# EAGLE design open-lux-T-fixbutt (EAGLE 6.5.0)
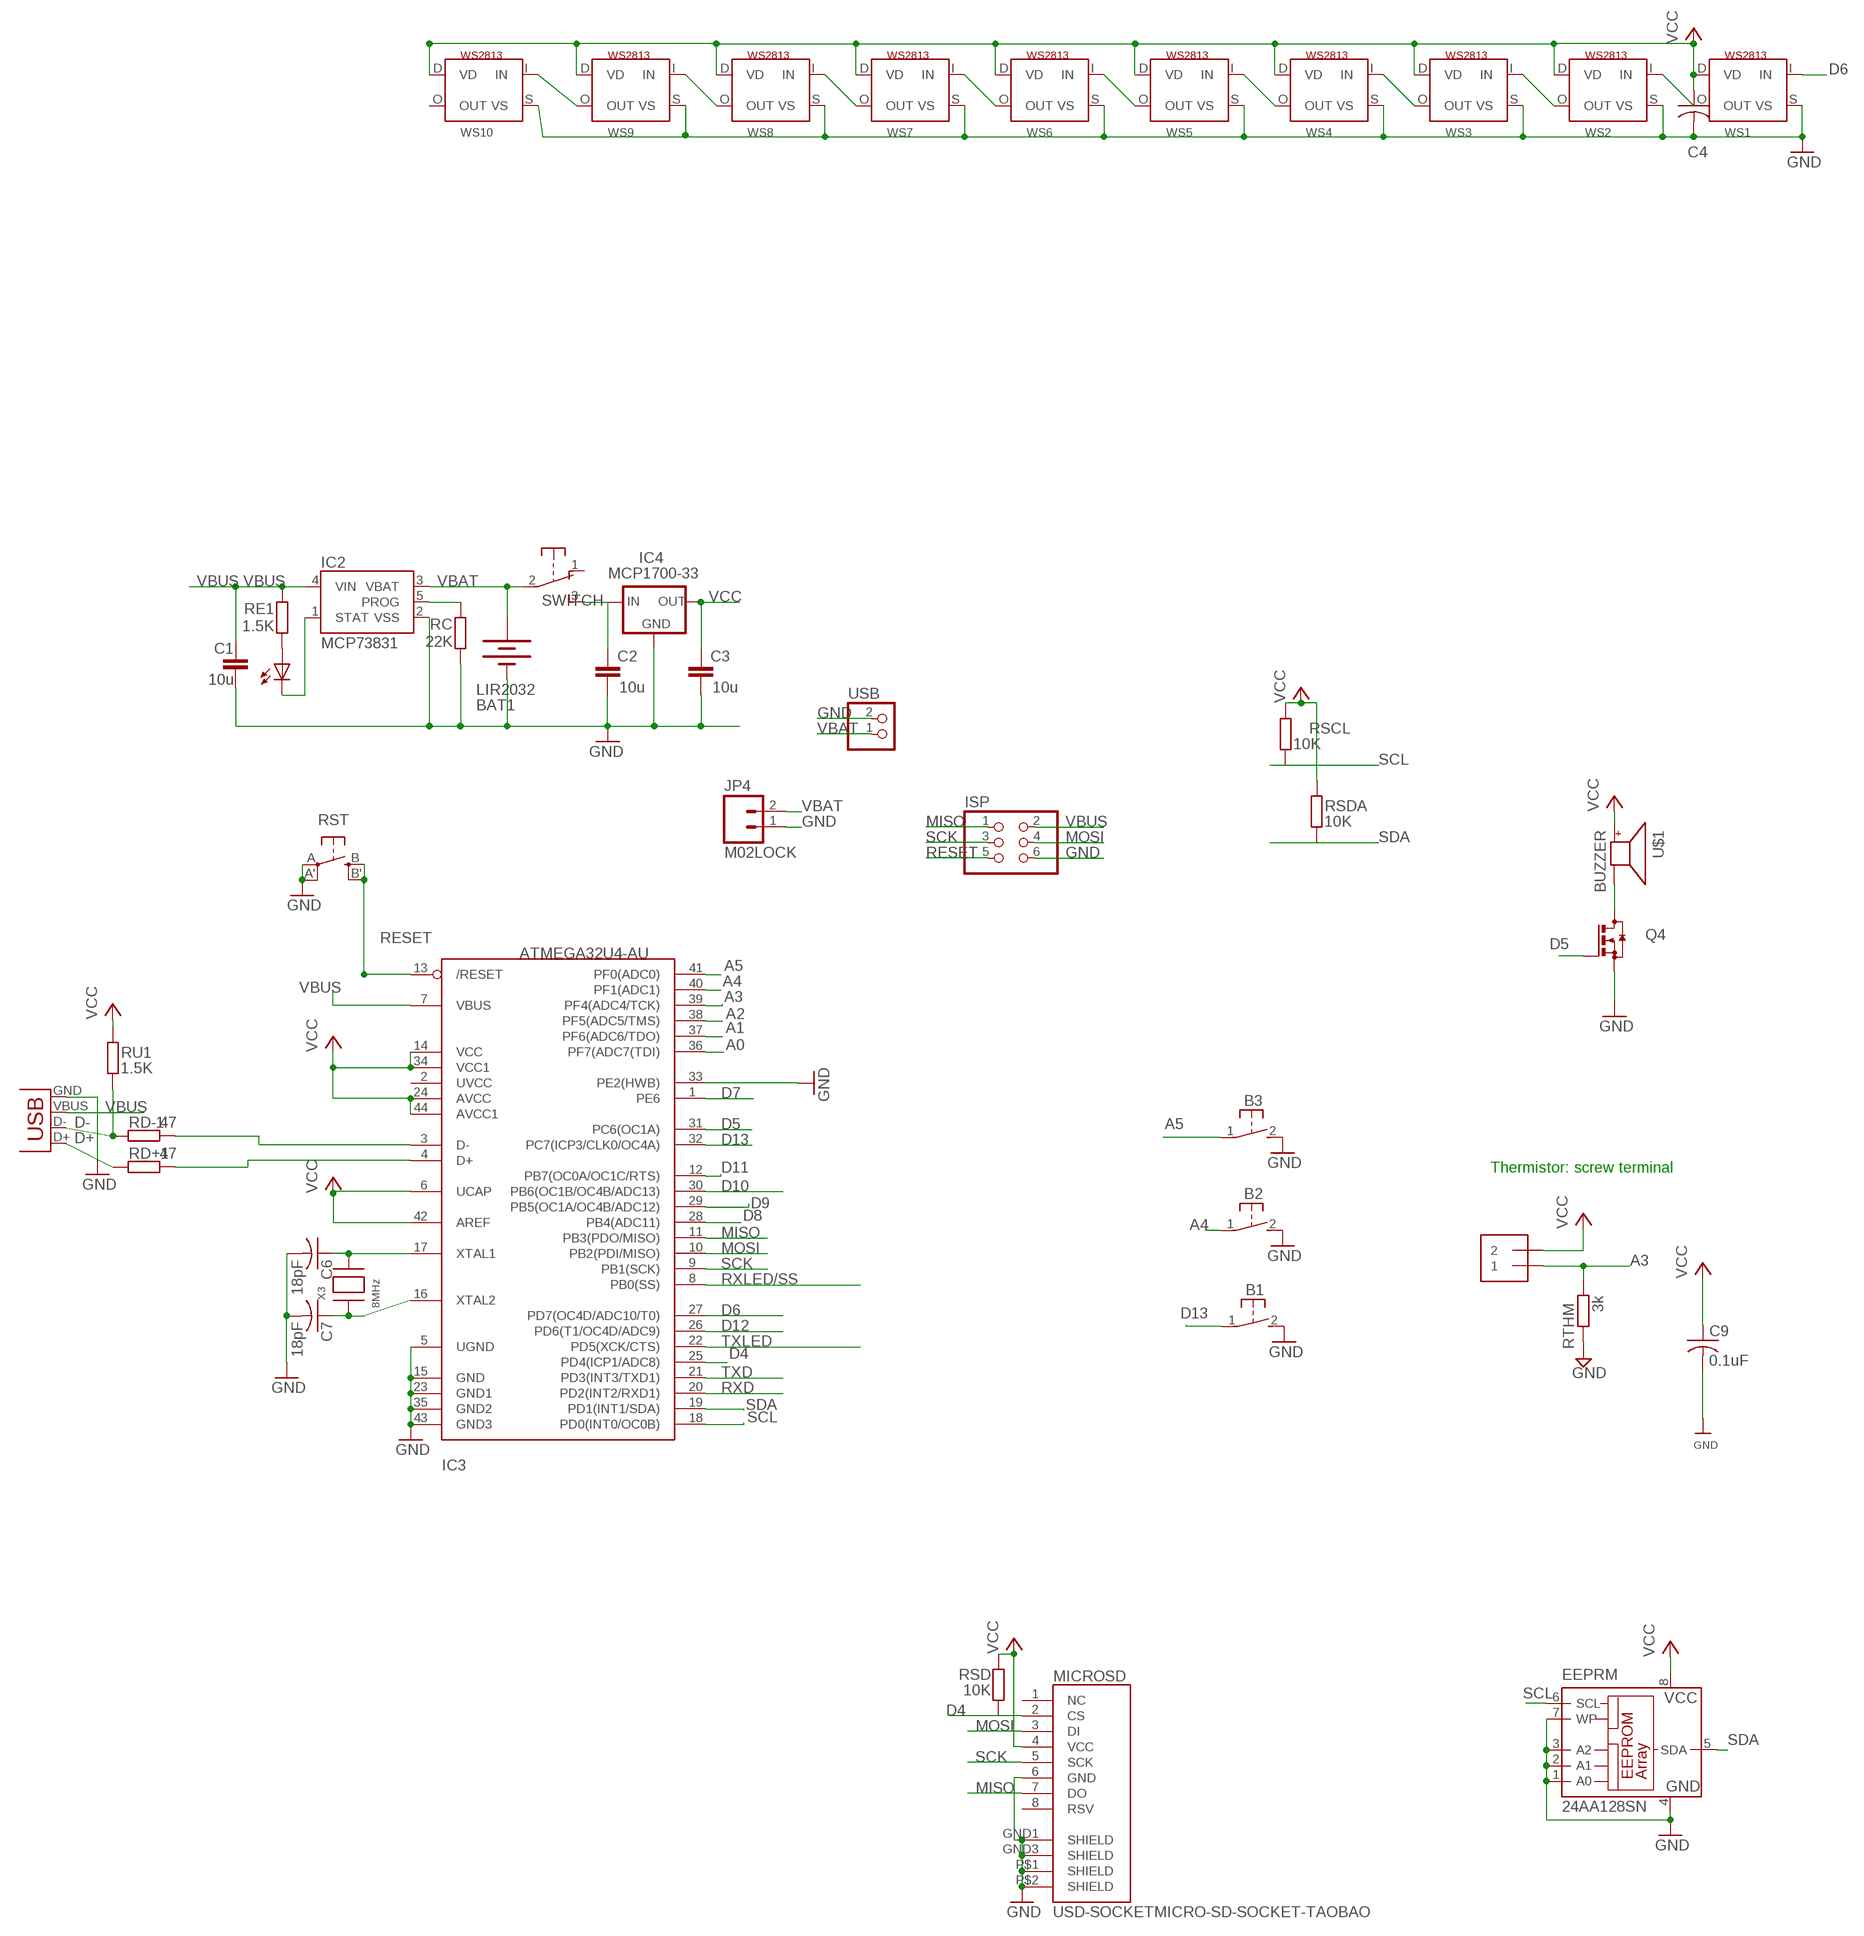
[diagram p0: schematic, sheet 1, part 1 of 2]
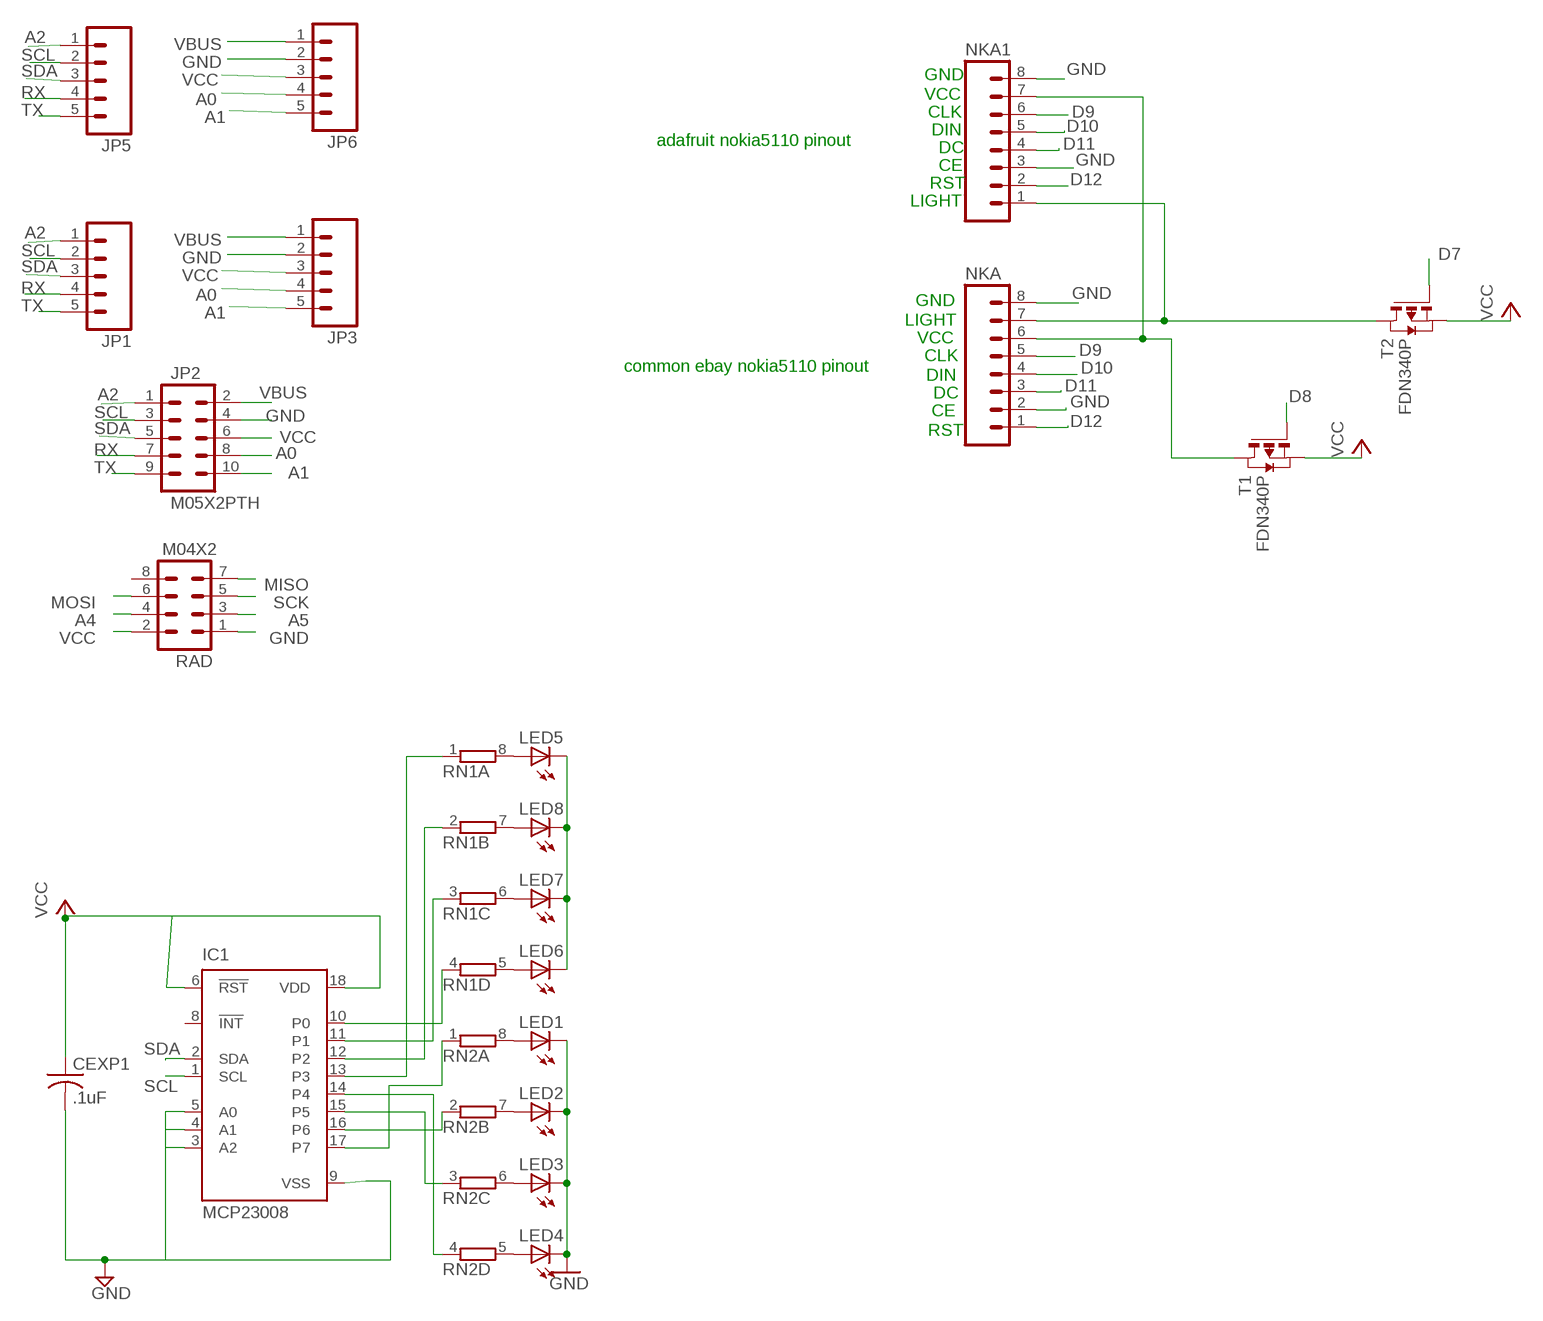
[diagram p1: schematic, sheet 1, part 2 of 2]

## Parts
B1  31-XX  [B3F-31XX]
B2  31-XX  [B3F-31XX]
B3  31-XX  [B3F-31XX]
BAT1  LIR2032  BATTERYBATTCOM_20MM_PTH_SMT  [BATTCOM_20MM_PTH_SMT]
C1  10u  C-EUC0805  [C0805]
C2  10u  C-EUC0805  [C0805]
C3  10u  C-EUC0805  [C0805]
C4  C-USC0805K  [C0805K]
C6  18pF  C-USC0805K  [C0805K]
C7  18pF  C-USC0805K  [C0805K]
C9  0.1uF  C-USC0805  [C0805]
CEXP1  .1uF  C-USC0805K  [C0805K]
EEPRM  24AA128SN  [SO-08]
IC1  MCP23008  MCP23008T  [SO18W]
IC2  MCP73831  [SOT23-5]
IC3  ATMEGA32U4-AU  [TQFP44]
IC4  MCP1700-33  MCP1700SOT233  [SOT23]
ISP  PINHD-2X3  [2X03]
JP1  M05LOCK  [1X05_LOCK]
JP2  M05X2PTH  [AVR_ICSP]
JP3  M05LOCK  [1X05_LOCK]
JP4  M02LOCK  [1X02_LOCK]
JP5  M05LOCK  [1X05_LOCK]
JP6  M05LOCK  [1X05_LOCK]
LED1  LED3MM  [LED3MM]
LED2  LED3MM  [LED3MM]
LED3  LED3MM  [LED3MM]
LED4  LED3MM  [LED3MM]
LED5  LED3MM  [LED3MM]
LED6  LED3MM  [LED3MM]
LED7  LED3MM  [LED3MM]
LED8  LED3MM  [LED3MM]
MICROSD  USD-SOCKETMICRO-SD-SOCKET-TAOBAO  [MICRO-SD-SOCKET-TAOBAO]
NKA  M08LOCK  [1X08_LOCK]
NKA1  M08LOCK  [1X08_LOCK]
PWR  0805  LEDCHIPLED_0805  [CHIPLED_0805]
Q4  BSS123  [SOT23]
RAD  M04X2  [2X4]
RC  22K  R-EU_R0805  [R0805]
RD+1  47  R-EU_R0805  [R0805]
RD-1  47  R-EU_R0805  [R0805]
RE1  1.5K  R-EU_R0805  [R0805]
RN1  4R-NEXB38V  [EXB38V]
RN2  4R-NEXB38V  [EXB38V]
RSCL  10K  R-EU_R0805  [R0805]
RSD  10K  R-EU_R0805  [R0805]
RSDA  10K  R-EU_R0805  [R0805]
RST  EVQQ2  [EVQ-Q2]
RTHM  3k  R-EU_0204/7  [0204/7]
RU1  1.5K  R-EU_R0805  [R0805]
SWITCH  EG1206  [EG1206]
T1  FDN340P  PMOSSOT23  [SOT-23]
T2  FDN340P  PMOSSOT23  [SOT-23]
THM1  1X2-3.5MM  [1X2-3.5MM]
U$1  BUZZER  [SMT-8585-BUZZER]
USB  JST_2PIN-SMT-RA  [JST-PH-2-SMT-RA]
WS1  WS2813  [RGBLED5050_4]
WS2  WS2813  [RGBLED5050_4]
WS3  WS2813  [RGBLED5050_4]
WS4  WS2813  [RGBLED5050_4]
WS5  WS2813  [RGBLED5050_4]
WS6  WS2813  [RGBLED5050_4]
WS7  WS2813  [RGBLED5050_4]
WS8  WS2813  [RGBLED5050_4]
WS9  WS2813  [RGBLED5050_4]
WS10  WS2813  [RGBLED5050_4]
X2  USBSMD  [USB-MINIB]
X3  8MHz  XTALNX5032  [NX5032]

## Nets
A0: IC3.36(PF7(ADC7(TDI)) JP2.8 JP3.4 JP6.4
A1: IC3.37(PF6(ADC6/TDO)) JP2.10 JP3.5 JP6.5
A2: IC3.38(PF5(ADC5/TMS)) JP1.1 JP2.1 JP5.1
A3: IC3.39(PF4(ADC4/TCK)) RTHM.2 THM1.1
A4: B2.1(P) IC3.40(PF1(ADC1)) RAD.4
A5: B3.1(P) IC3.41(PF0(ADC0)) RAD.3
D4: IC3.25(PD4(ICP1/ADC8)) MICROSD.2(CS) RSD.1
D5: IC3.31(PC6(OC1A)) Q4.1(G)
D6: IC3.27(PD7(OC4D/ADC10/T0)) WS1.I(IN)
D7: IC3.1(PE6) T2.3(G)
D8: IC3.28(PB4(ADC11)) T1.3(G)
D9: IC3.29(PB5(OC1A/OC4B/ADC12)) NKA1.6 NKA.5
D10: IC3.30(PB6(OC1B/OC4B/ADC13)) NKA1.5 NKA.4
D11: IC3.12(PB7(OC0A/OC1C/RTS)) NKA1.4 NKA.3
D12: IC3.26(PD6(T1/OC4D/ADC9)) NKA1.2 NKA.1
D13: B1.1(P) IC3.32(PC7(ICP3/CLK0/OC4A))
D+: RD+1.1 X2.D+
D-: RD-1.1 RU1.1 X2.D-
GND: B1.2(S) B2.2(S) B3.2(S) BAT1.P$1(-) C1.2 C2.2 C3.2 C4.2 C6.2 C7.2 C9.2 CEXP1.2 EEPRM.1(A0) EEPRM.2(A1) EEPRM.3(A2) EEPRM.4(GND) EEPRM.7(WP) IC1.3(A2) IC1.4(A1) IC1.5(A0) IC1.9(VSS) IC2.2(VSS) IC3.5(UGND) IC3.15(GND) IC3.23(GND1) IC3.33(PE2(HWB)) IC3.35(GND2) IC3.43(GND3) IC4.1(GND) ISP.6 JP2.4 JP3.2 JP4.1 JP6.2 LED1.K(C) LED2.K(C) LED3.K(C) LED4.K(C) MICROSD.6(GND) MICROSD.GND1(SHIELD) MICROSD.GND3(SHIELD) MICROSD.P$1(SHIELD) MICROSD.P$2(SHIELD) NKA1.3 NKA1.8 NKA.2 NKA.8 Q4.2(S) RAD.1 RC.1 RST.A'(P1) RST.A(P) RTHM.1 USB.2 WS1.S(VS) WS2.S(VS) WS3.S(VS) WS4.S(VS) WS5.S(VS) WS6.S(VS) WS7.S(VS) WS8.S(VS) WS9.S(VS) WS10.S(VS) X2.GND
MISO: IC3.11(PB3(PDO/MISO)) ISP.1 MICROSD.7(DO) RAD.7
MOSI: IC3.10(PB2(PDI/MISO)) ISP.4 MICROSD.3(DI) RAD.6
N$1: C2.1 IC4.3(IN) SWITCH.3(S)
N$2: C7.1 IC3.16(XTAL2) X3.P$1
N$3: C6.1 IC3.17(XTAL1) X3.P$2
N$4: WS9.O(OUT) WS10.I(IN)
N$5: IC2.1(STAT) PWR.C
N$6: IC2.5(PROG) RC.2
N$7: Q4.3(D) U$1.-
N$8: IC1.14(P4) RN2.4
N$9: T2.1(D)
N$10: PWR.A RE1.1
N$11: IC1.15(P5) RN2.3
N$12: NKA1.1 NKA.7
N$13: IC1.16(P6) RN2.2
N$14: WS6.O(OUT) WS7.I(IN)
N$15: IC1.17(P7) RN2.1
N$17: LED1.A RN2.8
N$18: LED2.A RN2.7
N$19: WS4.O(OUT) WS5.I(IN)
N$20: WS5.O(OUT) WS6.I(IN)
N$21: IC3.4(D+) RD+1.2
N$22: IC3.3(D-) RD-1.2
N$23: WS1.O(OUT) WS2.I(IN)
N$24: WS2.O(OUT) WS3.I(IN)
N$25: WS3.O(OUT) WS4.I(IN)
N$26: LED3.A RN2.6
N$27: WS8.O(OUT) WS9.I(IN)
N$28: WS7.O(OUT) WS8.I(IN)
N$29: LED4.A RN2.5
N$30: LED5.K(C) LED6.K(C) LED7.K(C) LED8.K(C)
N$31: NKA1.7 NKA.6 T1.1(D)
N$32: LED5.A RN1.8
N$33: LED6.A RN1.5
N$34: LED7.A RN1.6
N$35: LED8.A RN1.7
N$37: IC1.13(P3) RN1.1
N$38: IC1.12(P2) RN1.2
N$39: IC1.11(P1) RN1.3
N$40: IC1.10(P0) RN1.4
RESET: IC3.13(/RESET) ISP.5 RST.B'(S1) RST.B(S)
RX: JP1.4 JP2.7 JP5.4
RXD: IC3.20(PD2(INT2/RXD1))
RXLED/SS: IC3.8(PB0(SS))
SCK: IC3.9(PB1(SCK)) ISP.3 MICROSD.5(SCK) RAD.5
SCL: EEPRM.6(SCL) IC1.1(SCL) IC3.18(PD0(INT0/OC0B)) JP1.2 JP2.3 JP5.2 RSCL.1
SDA: EEPRM.5(SDA) IC1.2(SDA) IC3.19(PD1(INT1/SDA)) JP1.3 JP2.5 JP5.3 RSDA.1
TX: JP1.5 JP2.9 JP5.5
TXD: IC3.21(PD3(INT3/TXD1))
TXLED: IC3.22(PD5(XCK/CTS))
VBAT: BAT1.P$2(+) IC2.3(VBAT) JP4.2 SWITCH.2(P) USB.1
VBUS: C1.1 IC2.4(VIN) IC3.7(VBUS) ISP.2 JP2.2 JP3.1 JP6.1 RE1.2 X2.VBUS
VCC: C3.1 C4.1 C9.1 CEXP1.1 EEPRM.8(VCC) IC1.6(!RST) IC1.18(VDD) IC3.6(UCAP) IC3.14(VCC) IC3.24(AVCC) IC3.34(VCC1) IC3.42(AREF) IC3.44(AVCC1) IC4.2(OUT) JP2.6 JP3.3 JP6.3 MICROSD.4(VCC) RAD.2 RSCL.2 RSD.2 RSDA.2 RU1.2 T1.2(S) T2.2(S) THM1.2 U$1.+ WS1.D(VD) WS2.D(VD) WS3.D(VD) WS4.D(VD) WS5.D(VD) WS6.D(VD) WS7.D(VD) WS8.D(VD) WS9.D(VD) WS10.D(VD)
Unconnected: IC1.8(!INT) IC3.2(UVCC) MICROSD.1(NC) MICROSD.8(RSV) RAD.8 SWITCH.1(O) WS10.O(OUT)

## Notes on the sheet
- GND
- VCC
- CLK
- adafruit nokia5110 pinout | DIN
- DC
- CE
- RST
- LIGHT
- GND
- LIGHT
- VCC
- common ebay nokia5110 pinout | CLK
- DIN
- DC
- CE
- RST
- Thermistor: screw terminal

## Library data of the parts
B1-B3 = adafruit:31-XX: OMRON SWITCH Now with beefier pads!
BAT1 = SparkFunNew:BATTERY: Battery Holders Various common sizes : AA, AAA, 20mm coin cell and 12mm coin cell.
C1-C3 = resistor:C-EU: CAPACITOR, European symbol
C4 = adafruit2013:C-US: CAPACITOR, American symbol
C6 C7 C9 CEXP1 = adafruit:C-US: CAPACITOR, American symbol
EEPRM = microchip:24*: Serial EEPROM I2C; MF: MICROCHIP; MPN: 24AA128-I/SN; OC_FARNELL: unknown; OC_NEWARK: 92C6842
IC1 = JeeLabs:MCP23008: I2C-Bus Remote 8-bit I/O expander http://www.semiconductors.philips.com/acrobat_download/datasheets/PCF8574_4.pdf
IC2 = SparkFunNew:MCP73831: Microchip's MCP73831 Miniature single cell, fully integrated Li-Ion, Li-polymer charge management controller http://ww1.microchip.com/downloads/en/DeviceDoc/21984a.pdf
IC3 = adaprog:ATMEGA32U4
IC4 = adafruit:MCP1700: VOLTAGE REGULATOR
ISP = pinhead:PINHD-2X3: PIN HEADER
JP1 JP3 JP5 JP6 = SparkFun-Connectors:M05: Header 5 Standard 5-pin 0.1" header. Use with straight break away headers (SKU : PRT-00116), right angle break away headers (PRT-00553), swiss pins (PRT-00743), machine pins (PRT-00117), and female headers (PRT-00115). Molex polarized connector foot print use with SKU : PRT-08230 with associated crimp pins and housings.
JP2 = SparkFun-Connectors:M05X2: Header 5x2 Standard 10-pin dual row 0.1" header. Commonly used with AVR-ISP. Use with Spark Fun Electronics SKU: PRT-00778
JP4 = SparkFun-Connectors:M02: Standard 2-pin 0.1" header. Use with - straight break away headers ( PRT-00116) - right angle break away headers (PRT-00553) - swiss pins (PRT-00743) - machine pins (PRT-00117) - female headers (PRT-00115) Molex polarized connector foot print use with: PRT-08233 with associated crimp pins and housings. 2.54_SCREWTERM for use with PRT-10571. 3.5mm Screw Terminal footprints for PRT-08084 5mm Screw Terminal footprints for use with PRT-08433
LED1-LED8 = adafruit:LED: LED
MICROSD = SparkFunNew:USD-SOCKET: microSD Socket Push-push type uSD socket. Schematic element and footprint production proven. Spark Fun Electronics SKU : PRT-00127. tDoc lines correctly indicate media card edge positions when inserting (unlocked, locked, depressed).
NKA NKA1 = SparkFun-Connectors:M08: Header 8 Standard 8-pin 0.1" header. Use with straight break away headers (SKU : PRT-00116), right angle break away headers (PRT-00553), swiss pins (PRT-00743), machine pins (PRT-00117), and female headers (PRT-00115).
PWR = led:LED: LED
Q4 = transistor-small-signal:BSS123: N-CHANNEL MOS FET
RAD = SparkFun-Connectors:M04X2: .1" header, two rows of four.
RC RD+1 RD-1 RE1 RSCL RSD RSDA RTHM RU1 = rcl:R-EU_: RESISTOR, European symbol
RN1 RN2 = resistor-dil:4R-N: Array Chip Resistor Source: RS Component / Phycomp; OC_FARNELL: unknown; OC_NEWARK: unknown
RST = adafruit:EVQQ2: SMT 6mm switch, EVQQ2 series http://www.ladyada.net/library/eagle
SWITCH = adafruit:EG1206
T1 T2 = zetex:PMOSSOT23: MOS FET
THM1 = adafruit:1X2: 3.5mm Terminal block http://www.ladyada.net/library/pcb/eaglelibrary.html
U$1 = adafruit:BUZZER
USB = adafruit:JST_2PIN: JST 2-Pin Connectors of various flavors SMT-RA (S2B-PH-SM4) 4UConnector #17311 SMT (B2B-PH-SM4) THM-RA (S2B-PH) THM (B2B-PH)
WS1-WS10 = adafruit:WS2813
X2 = SparkFun:USB: USB Connectors USB-B-PTH is fully proven SKU : PRT-00139 USB-miniB is fully proven SKU : PRT-00587 USB-A-PCB is untested. USB-A-H is throughly reviewed, but untested. Spark Fun Electronics SKU : PRT-00437 USB-B-SMT is throughly reviewed, but untested. Needs silkscreen touching up. USB-A-S has not been used/tested USB-MB-H has not been used/tested
X3 = adaprog:XTAL

## Net classes
0 default: width 0.254 mm, clearance 0.254 mm
1 power: width 0.813 mm, clearance 0.203 mm

## Board
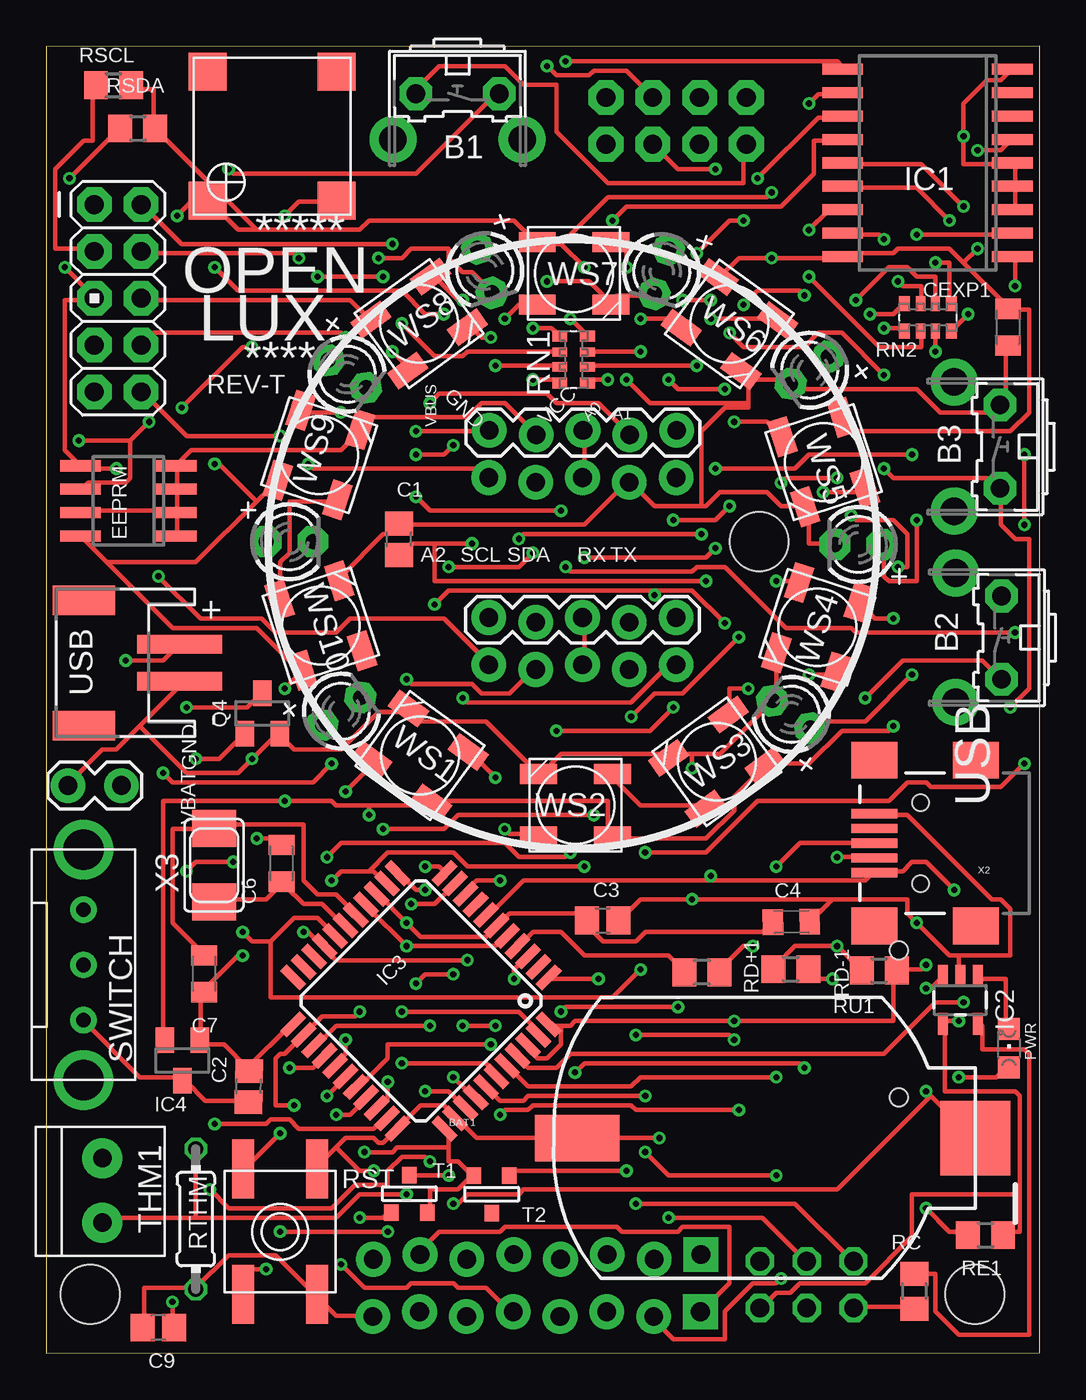
[diagram p2: board, top side]
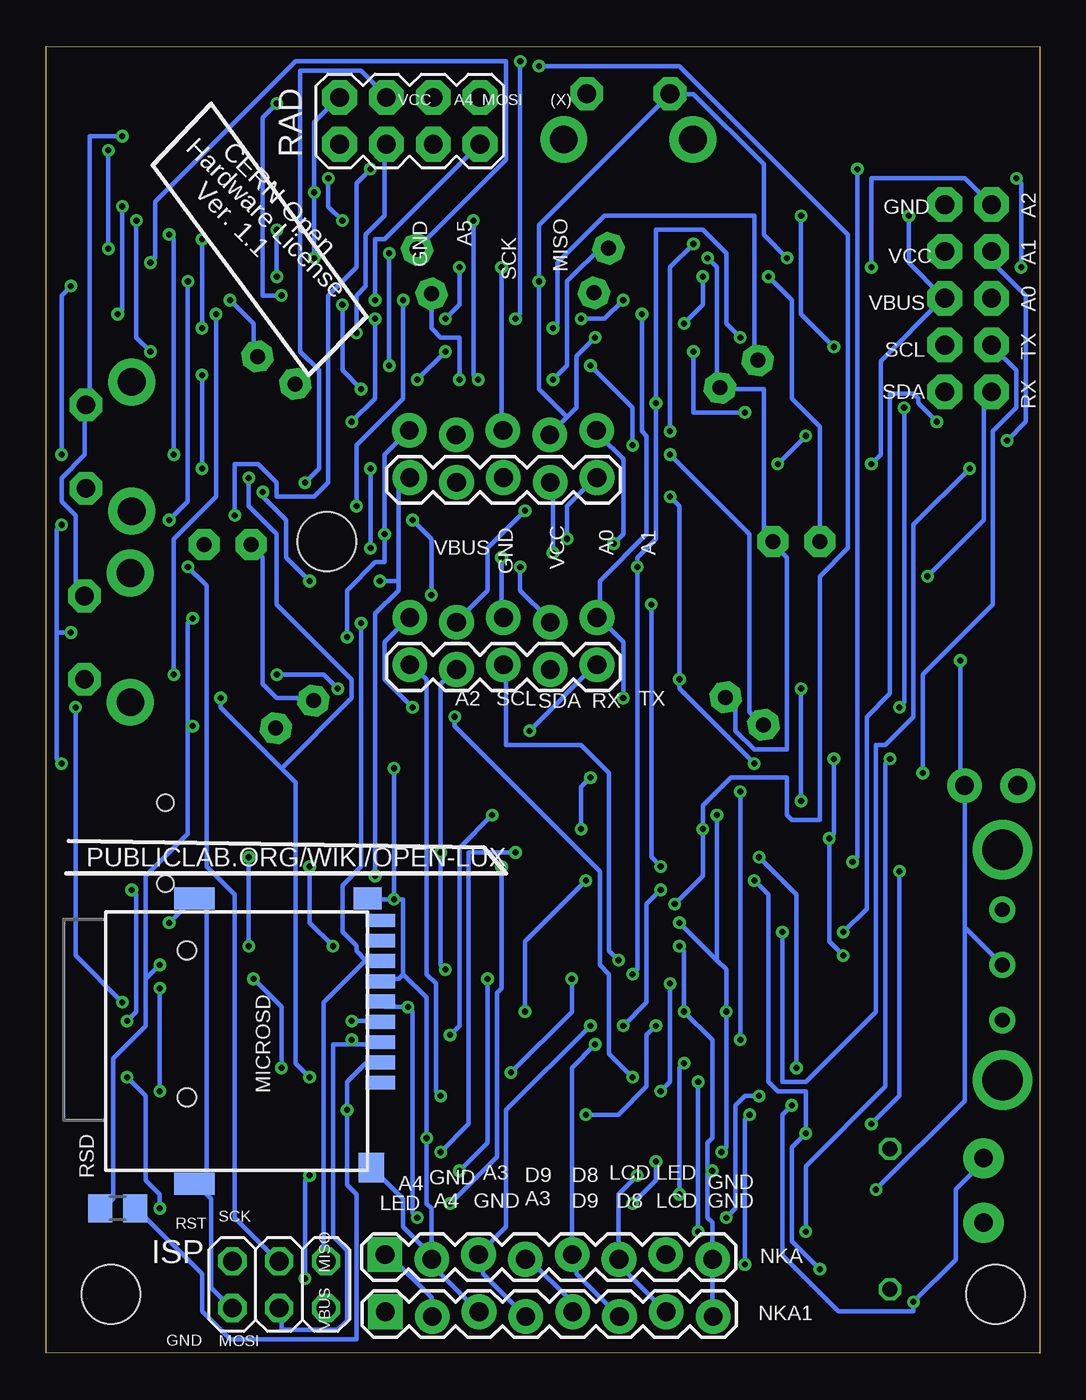
[diagram p3: board, bottom side, seen from below]

Size 53.92 x 70.93 mm. Coordinates in mm from the lower left corner, seen from the top.
Outline: 0,0 53.92,0.03 53.92,70.93 0,70.91 0,0
Copper layers (1*16): Top 0.0356mm / dielectric 1.5011mm / Bottom 0.0356mm
Design rules "LaenPCBOrder": minimum track width 6mil, minimum drill 13mil, track to track 6mil, track to pad 6mil, pad to pad 6mil, via to via 6mil, smd to smd 6mil, copper to edge 15mil, drill to drill 6mil, minimum pad ring 7mil, minimum via ring 7mil, stop-mask expansion 3mil, vias tented up to drill 0mil, thermal gap 10mil
Holes 3.2 mm at 50.4,3.2 2.4,3.2 38.69,44.04

### Footprints (pad centres in the part's own frame; a part is rotated, then mirrored left to right if it is on the bottom)
B3F-31XX = drill 1.016 pad 1.778 octagon: 1 -2.261,-1.245; 2 2.261,-1.245 | drill 1.499 pad 2.54: 3 -3.505,1.245; 4 3.505,1.245
BATTCOM_20MM_PTH_SMT = smd 4.572 x 2.54: P$1 0,0 | smd 3.81 x 4.064: P$2 21.59,0
C0805 = smd 1.3 x 1.5: 1 -0.85,0; 2 0.85,0
C0805K = smd 1.1 x 1.4: 1 -1,0; 2 1,0
SO-08 = smd 0.6 x 2.2: 1 -1.905,-2.6; 2 -0.635,-2.6; 3 0.635,-2.6; 4 1.905,-2.6; 5 1.905,2.6; 6 0.635,2.6; 7 -0.635,2.6; 8 -1.905,2.6
SO18W = smd 0.6 x 2.2: 1 -5.08,-4.6; 2 -3.81,-4.6; 3 -2.54,-4.6; 4 -1.27,-4.6; 5 0,-4.6; 6 1.27,-4.6; 7 2.54,-4.6; 8 3.81,-4.6; 9 5.08,-4.6; 10 5.08,4.6; 11 3.81,4.6; 12 2.54,4.6; 13 1.27,4.6; 14 0,4.6; 15 -1.27,4.6; 16 -2.54,4.6; 17 -3.81,4.6; 18 -5.08,4.6
SOT23-5 = smd 0.55 x 1.2: 1 -0.95,-1.3; 2 0,-1.3; 3 0.95,-1.3; 4 0.95,1.3; 5 -0.95,1.3
TQFP44 = smd 1.5 x 0.5: 1 -5.8,4; 2 -5.8,3.2; 3 -5.8,2.4; 4 -5.8,1.6; 5 -5.8,0.8; 6 -5.8,0; 7 -5.8,-0.8; 8 -5.8,-1.6; 9 -5.8,-2.4; 10 -5.8,-3.2; 11 -5.8,-4; 23 5.8,-4; 24 5.8,-3.2; 25 5.8,-2.4; 26 5.8,-1.6; 27 5.8,-0.8; 28 5.8,0; 29 5.8,0.8; 30 5.8,1.6; 31 5.8,2.4; 32 5.8,3.2; 33 5.8,4 | smd 0.5 x 1.5: 12 -4,-5.8; 13 -3.2,-5.8; 14 -2.4,-5.8; 15 -1.6,-5.8; 16 -0.8,-5.8; 17 0,-5.8; 18 0.8,-5.8; 19 1.6,-5.8; 20 2.4,-5.8; 21 3.2,-5.8; 22 4,-5.8; 34 4,5.8; 35 3.2,5.8; 36 2.4,5.8; 37 1.6,5.8; 38 0.8,5.8; 39 0,5.8; 40 -0.8,5.8; 41 -1.6,5.8; 42 -2.4,5.8; 43 -3.2,5.8; 44 -4,5.8
SOT23 = smd 1 x 1.4: 1 -0.95,-1.1; 2 0.95,-1.1; 3 0,1.1
2X03 = drill 1.016 octagon: 1 -2.54,-1.27; 2 -2.54,1.27; 3 0,-1.27; 4 0,1.27; 5 2.54,-1.27; 6 2.54,1.27
1X05_LOCK = drill 1.016 pad 1.88: 1 0,0.127; 2 2.54,-0.127; 3 5.08,0.127; 4 7.62,-0.127; 5 10.16,0.127
AVR_ICSP = drill 1.016 pad 1.88 octagon: 1 -1.27,5.08; 2 1.27,5.08; 3 -1.27,2.54; 4 1.27,2.54; 5 -1.27,0; 6 1.27,0; 7 -1.27,-2.54; 8 1.27,-2.54; 9 -1.27,-5.08; 10 1.27,-5.08
1X02_LOCK = drill 1.016 pad 1.88: 1 -0.178,0; 2 2.718,0
LED3MM = drill 0.813 pad 1.676 octagon: A -1.27,0; K 1.27,0
MICRO-SD-SOCKET-TAOBAO = smd 0.75 x 1.6: 1 2.25,10.5; 2 1.15,10.5; 3 0.05,10.5; 4 -1.05,10.5; 5 -2.15,10.5; 6 -3.25,10.5; 7 -4.35,10.5; 8 -5.45,10.5 | smd 0.7 x 1.6: CD -6.55,10.5 | smd 1.2 x 1.5: GND1 -7.75,9.8 | smd 1.6 x 1.4: GND3 6.85,10 | smd 1.2 x 2.2: P$1 7.75,0.4; P$2 -7.75,0.4 | hole 1: 3.05,0; -4.93,0
1X08_LOCK = drill 1.016 pad 1.88 square: 1 0,0.127 | drill 1.016 pad 1.88: 2 2.54,-0.127; 3 5.08,0.127; 4 7.62,-0.127; 5 10.16,0.127; 6 12.7,-0.127; 7 15.24,0.127; 8 17.78,-0.127
CHIPLED_0805 = smd 1.2 x 1.2: A 0,-1.05; C 0,1.05
2X4 = drill 1.016 pad 1.88 octagon: 1 -3.81,-1.27; 2 -3.81,1.27; 3 -1.27,-1.27; 4 -1.27,1.27; 5 1.27,-1.27; 6 1.27,1.27; 7 3.81,-1.27; 8 3.81,1.27
R0805 = smd 1.3 x 1.5: 1 -0.95,0; 2 0.95,0
EXB38V = smd 0.6 x 0.8: 1 -1.275,-0.75; 4 1.275,-0.75; 5 1.275,0.75; 8 -1.275,0.75 | smd 0.5 x 0.8: 2 -0.4,-0.75; 3 0.4,-0.75; 6 0.4,0.75; 7 -0.4,0.75
EVQ-Q2 = smd 3.2 x 1.2: A -3.4,-2; A' 3.4,-2; B -3.4,2; B' 3.4,2
0204/7 = drill 0.813 octagon: 1 -3.81,0; 2 3.81,0
EG1206 = drill 0.8 pad 1.422: 1 -3,0; 2 0,0; 3 3,0 | drill 2.2: MT1 -6.25,0; MT2 6.25,0
SOT-23 = smd 0.787 x 0.889: 1 0.025,-1.016; 2 -0.94,1.016; 3 0.991,1.016
1X2-3.5MM = drill 1 pad 2.184: 1 1.8,0; 2 -1.7,0
SMT-8585-BUZZER = smd 2.05 x 2.05: + -3.5,-3.5; - 3.5,-3.5; NC1 -3.5,3.5; NC2 3.5,3.5
JST-PH-2-SMT-RA = smd 1 x 4.6: 1 1,-3.7; 2 -1,-3.7 | smd 1.6 x 3.4: NC1 -3.4,1.5; NC2 3.4,1.5
RGBLED5050_4 = smd 2 x 1.1: D -2,1.7; I 2,1.7; O -2,-1.7; S 2,-1.7
USB-MINIB = smd 2.5 x 0.5: D+ 2.5,0; D- 2.5,0.8; GND 2.5,-1.6; ID 2.5,-0.8; VBUS 2.5,1.6 | smd 2.5 x 2: GND@1 -3,-4.5; GND@2 -3,4.5; GND@3 2.5,4.5; GND@4 2.5,-4.5 | hole 0.9: 0,2.2; 0,-2.2
NX5032 = smd 2 x 2.4: P$1 2,0; P$2 -2,0

### Placement (x,y rotation side)
B1  22.33,67.11 180 top
B2  50.6,38.84 90 top
B3  50.52,49.2 90 top
BAT1  28.83,11.68 0 top
C1  19.15,44.17 90 top
C2  11,14.48 89 top
C3  30.2,23.5 0 top
C4  40.44,23.42 1 top
C6  12.78,26.59 90 top
C7  8.59,20.6 270 top
C9  6.1,1.4 180 top
CEXP1  52.2,55.68 270 top
EEPRM  4.47,46.25 90 top
IC1  47.83,64.59 90 top
IC2  49.61,19.18 180 top
IC3  20.35,19.13 225 top
IC4  7.39,15.9 180 top
ISP  41.27,3.73 180 bottom
JP1  24.03,39.8 0 top
JP2  3.89,57.25 0 top
JP3  24.05,49.96 0 top
JP4  1.37,30.81 0 top
JP5  34.19,37.24 0 bottom
JP6  34.19,47.4 0 bottom
LED1  40.44,34.67 144 top
LED2  44.07,43.89 180 top
LED3  41.43,53.34 216 top
LED4  33.4,58.7 252 top
LED5  23.8,58.75 288 top
LED6  16.33,53.14 324 top
LED7  13.21,44.04 0 top
LED8  16.03,34.85 36 top
MICROSD  46.28,16.94 270 bottom
NKA  35.53,5.23 0 bottom
NKA1  35.51,2.13 0 bottom
PWR  52.25,16.56 0 top
Q4  11.73,34.72 0 top
RAD  34.19,66.88 0 bottom
RC  47.12,3.38 90 top
RD+1  35.59,20.68 180 top
RD-1  40.41,20.85 0 top
RE1  50.98,6.43 0 top
RN1  28.63,53.92 90 top
RN2  47.85,56.21 0 top
RSCL  3.66,68.81 0 top
RSD  50.04,7.87 180 bottom
RSDA  4.98,66.47 0 top
RST  12.7,6.6 90 top
RTHM  8.13,7.29 90 top
RU1  45.21,20.78 0 top
SWITCH  2.03,21.08 270 top
T1  19.74,8.66 180 top
T2  24.16,8.64 0 top
THM1  3.05,8.89 270 top
U$1  12.27,66.04 0 top
USB  3.56,37.47 90 top
WS1  20.29,32.44 144 top
WS2  28.73,29.74 180 top
WS3  36.4,32.11 216 top
WS4  41.86,39.4 252 top
WS5  42.19,48.36 288 top
WS6  37.08,55.85 324 top
WS7  28.65,58.6 0 top
WS8  20.24,55.88 36 top
WS9  14.81,48.74 72 top
WS10  14.91,39.5 108 top
X2  47.45,27.69 180 top
X3  9.12,26.49 90 top

### Tracks (layer width: path | path; a pad name or v marks a point on that pad's centre or on a via)
A0  (via drill 0.33)
  Top 0.254: v20.57,14.22 21.84,14.22 22.61,13.46 IC3.36 | v20.07,20.07 20.57,20.57 v22.1,20.57 | v20.83,51.56 21.34,52.07 27.18,52.07 27.69,51.56 29.97,51.56 31.5,50.04 JP3.4 | v16.26,55.12 16,55.37 5.84,55.37 5.33,54.86 JP2.8 | v26.42,43.43 25.65,42.67 v21.84,42.67
  Bottom 0.254: v20.57,14.22 20.07,14.73 v20.07,20.07 | v22.1,20.57 21.84,20.83 v21.84,42.67 21.84,43.18 20.83,44.2 v20.83,51.56 20.83,60.96 18.29,60.96 17.02,59.69 17.02,55.88 v16.26,55.12 | v26.42,43.43 26.42,47.24 JP6.4
A1  (via drill 0.33)
  Top 0.254: v22.1,14.99 23.11,13.97 IC3.37 | v31.75,34.54 33.02,35.81 34.54,35.81 v37.59,38.86 | v25.65,44.2 25.91,44.45 v35.56,44.45 | v12.7,49.78 7.62,49.78 5.33,52.07 JP2.10 | v14.22,48.26 14.48,48.01 23.62,48.01 23.88,47.75 JP6.5
  Bottom 0.254: v22.1,14.99 23.37,16.26 23.37,20.57 23.88,21.08 23.88,26.16 31.75,34.04 v31.75,34.54 | v37.59,38.86 37.59,41.4 36.07,42.93 35.56,42.93 v35.56,44.45 35.56,48.77 34.29,50.04 JP3.5 | v25.65,44.2 25.65,45.97 24.13,47.5 JP6.5 | v14.22,48.26 v12.7,49.78
A2  (via drill 0.33)
  Top 0.254: v32.51,13.97 26.16,13.97 25.91,13.72 24.64,13.72 24.13,14.22 IC3.38 | v22.61,35.56 22.86,35.31 31.75,35.31 33.78,37.34 34.04,37.34 JP5.1 | v9.14,58.93 10.41,57.66 19.3,57.66 20.57,56.39 v21.59,56.39
  Bottom 0.254: v32.51,13.97 32.77,14.22 32.77,20.07 33.27,20.57 33.27,36.58 34.04,37.34 JP5.1 | v22.61,35.56 22.61,38.61 23.88,39.88 JP1.1 23.88,40.13 23.88,41.91 21.34,44.45 21.34,49.78 21.59,50.04 v21.59,56.39 | v9.14,58.93 9.14,63.75 4.06,63.75 2.79,62.48 JP2.1
A3  (via drill 0.33)
  Top 0.254: v19.3,15.75 23.88,15.75 24.38,15.24 IC3.39 | v19.56,8.64 17.02,8.64 15.75,7.37 8.13,7.37 | 8.13,7.37 3.3,7.37 3.05,7.11 THM1.1 | 8.13,7.37 RTHM.2
  Bottom 0.254: v19.3,15.75 19.56,15.49 v19.56,8.64
A4  (via drill 0.33)
  Top 0.254: v39.62,14.99 32.26,14.99 31.75,14.48 26.16,14.48 25.15,15.49 IC3.40 | v44.45,35.56 46.48,37.59 50.8,37.59 51.82,36.58 B2.1 | v39.88,47.24 40.13,47.5 v42.93,47.5
  Bottom 0.254: v39.62,14.99 40.39,15.75 40.39,30.99 41.15,31.75 | 41.15,31.75 44.45,35.05 v44.45,35.56 | v39.88,47.24 39.12,48.01 39.12,53.34 40.13,54.36 40.13,69.6 36.83,69.6 35.56,68.33 RAD.4 | v42.93,47.5 42.93,45.97 41.4,44.45 41.4,40.64 37.34,36.58 37.34,35.56 41.15,31.75
A5  (via drill 0.33)
  Top 0.254: v49.78,19.05 48.26,19.05 45.47,16.26 28.45,16.26 27.69,15.49 26.16,15.49 25.65,16 IC3.41 | v52.32,35.05 53.34,36.07 53.34,44.2 52.58,44.2 51.82,44.96 51.82,46.74 B3.1 51.56,46.99 51.05,47.5 45.97,47.5 v45.47,48.01 | v37.08,55.37 37.85,54.61 41.15,54.61 41.91,55.37 43.18,55.37 v45.47,53.09
  Bottom 0.254: v49.78,19.05 52.32,21.59 v52.32,35.05 | v37.08,55.37 37.08,57.4 36.58,57.91 36.58,60.71 35.56,61.72 35.56,65.53 RAD.3 | v45.47,48.01 v45.47,53.09
D4  (via drill 0.33)
  Top 0.254: v20.83,17.78 15.75,17.78 14.73,16.76 IC3.25 | v24.64,12.95 24.89,13.21 26.16,13.21 26.42,13.46 31.75,13.46 32,13.21 v37.59,13.21
  Bottom 0.254: RSD.1 49.02,7.87 45.47,4.32 45.47,2.29 43.94,0.76 37.08,0.76 37.08,8.64 37.59,9.14 v37.59,13.21 37.59,14.73 36.58,15.75 35.81,15.75 MICROSD.2 | v20.83,17.78 21.34,17.27 21.34,14.48 22.86,12.95 v24.64,12.95
D5  (via drill 0.33)
  Top 0.254: v8.13,32.26 9.4,32.26 10.67,33.53 Q4.1 | v18.54,6.6 v12.7,6.6 | v18.54,14.73 18.54,13.72 18.29,13.72 18.03,13.46 IC3.31
  Bottom 0.254: v8.13,32.26 8.38,32 8.38,14.48 12.7,10.16 v12.7,6.6 | v18.54,14.73 v18.54,6.6
D6  (via drill 0.33)
  Top 0.254: v16.26,17.02 16.26,16.26 15.75,15.75 IC3.27 | v16.26,30.48 17.78,32 WS1.I
  Bottom 0.254: v16.26,30.48 v16.26,17.02
D7  (via drill 0.33)
  Top 0.254: T2.3 25.4,9.91 v31.5,9.91 | v29.97,20.32 27.43,20.32 IC3.1
  Bottom 0.254: v31.5,9.91 29.97,11.43 v29.97,20.32
D8  (via drill 0.33)
  Top 0.254: v17.02,7.37 18.29,7.37 18.54,7.62 T1.3 | v15.24,13.97 16.26,14.99 IC3.28
  Bottom 0.254: v17.02,7.37 16.51,7.87 16.51,13.46 16,13.97 v15.24,13.97
D9  (via drill 0.33)
  Top 0.254: v24.13,16.76 18.54,16.76 18.54,16 17.02,14.48 IC3.29
  Bottom 0.254: v24.13,16.76 25.4,15.49 25.4,5.59 NKA.5 25.15,5.33 25.15,4.32 22.86,2.03 NKA1.6
D10  (via drill 0.33)
  Top 0.254: v15.75,12.95 16.51,12.95 17.27,13.72 IC3.30 | v16,4.83 17.27,3.56 19.56,3.56 19.81,3.81 22.1,3.81 22.35,3.56 23.88,3.56 25.15,2.29 NKA1.5
  Bottom 0.254: v15.75,12.95 16,12.7 v16,4.83 | NKA.4 27.69,5.08 25.4,2.79 25.4,2.29 NKA1.5
D11  (via drill 0.33)
  Top 0.254: v20.57,25.15 20.07,25.15 19.3,25.91 IC3.12 | v24.38,17.78 v22.61,17.78
  Bottom 0.254: v20.57,25.15 21.34,24.38 21.34,19.05 v22.61,17.78 | v24.38,17.78 28.96,13.21 28.96,6.86 NKA.3 30.23,5.33 30.23,4.32 27.94,2.03 NKA1.4
D12  (via drill 0.33)
  Top 0.254: v13.21,15.49 14.48,15.49 14.99,16 IC3.26 | v15.24,26.92 16,27.69 24.89,27.69 25.65,26.92 28.19,26.92 v28.45,27.18 | v32.51,10.92 33.78,9.65 v39.62,9.65 | v39.88,4.06 39.62,3.81 38.35,3.81 36.83,2.29 36.83,0.76 34.04,0.76 33.02,1.78 NKA1.2
  Bottom 0.254: v13.21,15.49 13.21,24.89 v15.24,26.92 | v28.45,27.18 30.99,27.18 30.99,12.45 v32.51,10.92 | v39.62,9.65 39.88,9.4 v39.88,4.06 | NKA.1 35.31,5.33 33.02,3.05 33.02,2.03 NKA1.2
D13  (via drill 0.33)
  Top 0.254: v9.14,12.45 11.94,12.45 12.19,12.7 13.21,12.7 13.72,12.19 17.78,12.19 18.29,12.7 IC3.32 | v7.62,26.16 8.13,26.67 v10.16,26.67 | v9.91,64.26 10.16,64.01 20.07,64.01 24.38,68.33 B1.1
  Bottom 0.254: v9.14,12.45 7.62,13.97 v7.62,26.16 | v10.16,26.67 9.91,26.92 v9.91,64.26
D+  (via drill 0.33)
  Top 0.254: v38.35,22.1 37.85,22.1 36.58,20.83 RD+1.1 | v39.62,26.42 40.89,27.69 X2.D+
  Bottom 0.254: v38.35,22.1 39.62,23.37 v39.62,26.42
D-  (via drill 0.33)
  Top 0.254: RU1.1 44.2,20.83 v42.93,22.1 40.64,22.1 39.62,21.08 RD-1.1 | v42.93,26.92 44.7,26.92 X2.D-
  Bottom 0.254: v42.93,22.1 v42.93,26.92
GND  (via drill 0.33)
  Top 0.254: 15.75,11.18 16.26,11.68 17.78,11.68 18.03,11.43 18.29,11.43 19.05,12.19 IC3.33 19.3,12.45 20.32,13.46 21.59,13.46 22.1,12.95 IC3.35 22.35,12.7 23.37,11.68 BAT1.P$1 v33.27,11.68 | 15.75,11.18 14.73,10.16 RST.A' | 8.13,3.56 5.33,3.56 5.33,1.52 C9.2 | NKA1.8 17.53,2.03 15.75,2.03 14.73,3.05 RST.A 14.48,3.3 12.45,5.33 9.91,5.33 8.13,3.56 | 8.13,3.56 RTHM.1 | IC3.15 17.53,24.13 v19.56,22.1 24.38,22.1 24.89,22.61 IC3.5 | v19.3,18.54 25.65,18.54 26.67,17.53 IC3.43 | 15.75,11.18 17.02,9.91 v17.78,9.91 | RC.1 46.99,2.54 43.94,2.54 ISP.6 | 49.53,21.59 49.53,20.57 IC2.2 | 49.53,21.59 49.02,21.59 v47.24,23.37 46.74,23.88 46.74,24.64 42.67,24.64 | 42.67,24.64 41.66,23.62 C4.2 | 42.67,24.64 v35.05,24.64 32.26,24.64 31.24,23.62 C3.2 | 49.53,21.59 52.32,21.59 52.32,24.13 51.82,24.64 51.31,24.64 46.74,29.21 44.96,29.21 X2.GND | EEPRM.7 2.03,45.72 6.86,45.72 EEPRM.2 | EEPRM.1 7.11,44.45 7.11,45.47 EEPRM.2 | EEPRM.2 7.11,45.72 7.11,46.74 EEPRM.3 7.11,46.99 7.11,48.01 EEPRM.4 7.11,48.26 7.87,49.02 16,49.02 17.02,50.04 WS9.S 17.27,50.29 17.78,50.8 22.86,50.8 23.62,51.56 24.89,51.56 26.42,50.04 JP3.2 | LED4.K 32.77,57.4 30.99,57.4 30.73,57.15 WS7.S 30.48,57.15 29.46,58.17 v27.18,58.17 | v24.13,55.12 23.62,55.12 23.11,55.63 WS8.S | v13.72,59.44 13.46,59.69 5.33,59.69 JP2.4 | RAD.1 37.85,65.53 37.85,63.5 30.48,63.5 27.69,66.29 27.69,68.83 25.91,68.83 24.89,69.85 21.34,69.85 20.07,68.58 B1.2 | IC1.3 52.58,62.23 52.58,63.25 IC1.4 52.58,63.5 52.58,64.52 IC1.5 52.32,64.52 49.78,64.52 v49.78,66.04 49.78,67.82 51.05,69.09 51.82,69.09 52.32,69.6 IC1.9 | 38.1,52.83 37.85,53.09 WS6.S 38.1,52.83
  Top 0.254: 38.1,52.83 40.39,52.83 LED3.K 40.64,52.58 40.89,52.32 47.24,52.32 48.51,51.05 51.31,51.05 51.56,51.31 B3.2 51.82,51.56 52.07,51.56 52.07,54.61 CEXP1.2 | 5.08,34.04 7.37,36.32 USB.2 | 5.08,34.04 3.81,32.77 3.05,32.77 1.27,30.99 JP4.1 | 10.92,15.49 9.65,16.76 8.38,16.76 IC4.1 8.38,17.02 8.38,19.56 C7.2 8.64,19.81 10.41,21.59 v10.67,21.59 | 10.92,15.49 13.21,17.78 IC3.23 | 10.92,15.49 C2.2 | v11.43,27.94 12.45,27.94 12.7,27.69 C6.2 | 5.08,34.04 7.62,31.5 10.41,31.5 v11.18,32.26 12.45,33.53 Q4.2 12.7,33.53 13.46,32.77 16,32.77 18.03,34.8 19.56,34.8 WS1.S 19.81,34.8 20.32,34.29 23.88,34.29 26.67,31.5 WS2.S 26.92,31.5 27.94,32.51 33.53,32.51 WS3.S 33.78,32.51 35.05,32.51 | WS10.S 16,42.16 18.29,44.45 18.54,44.45 19.05,44.96 C1.2 19.3,44.96 29.21,44.96 31.5,47.24 JP6.2 31.75,47.24 33.02,45.97 35.56,45.97 | LED2.K 42.67,43.94 41.4,43.94 41.4,45.72 WS5.S 41.15,45.97 39.88,45.97 39.12,46.74 36.58,46.74 35.81,45.97 35.56,45.97 | WS4.S 39.62,37.85 39.62,35.56 LED1.K 39.37,35.31 36.58,32.51 35.05,32.51 | 38.1,51.56 38.1,51.31 36.83,51.31 35.56,50.04 35.56,45.97 | 38.1,51.56 38.1,52.83 | v31.5,52.83 32.77,51.56 38.1,51.56 | 35.05,32.51 v35.05,31.75
  Bottom 0.254: 18.03,9.91 18.03,7.37 17.78,7.11 17.78,5.33 NKA.8 17.78,5.08 17.78,2.03 NKA1.8 | 18.03,9.91 18.03,11.43 17.78,11.68 17.78,17.02 v19.3,18.54 19.3,21.84 v19.56,22.1 | 18.03,9.91 v17.78,9.91 | v35.05,24.64 34.54,24.64 34.54,20.57 | v35.05,24.64 36.32,24.64 MICROSD.GND1 | 34.54,20.57 34.8,20.32 35.56,20.32 MICROSD.6 | 33.02,5.33 34.54,6.86 34.54,8.38 36.07,9.91 MICROSD.GND3 | 34.54,20.57 33.27,19.3 v33.27,11.68 33.27,8.13 33.02,7.87 33.02,5.33 | 33.02,5.33 NKA.2 32.77,5.08 32.77,4.57 30.48,2.29 NKA1.3 | 45.21,8.64 44.96,8.38 44.96,3.56 43.94,2.54 ISP.6 | 45.21,8.64 45.72,9.14 MICROSD.P$1 45.21,8.64 | 45.21,8.64 45.21,24.13 45.72,24.64 MICROSD.P$2 45.97,24.64 v47.24,23.37 | v24.13,55.12 25.15,54.1 25.15,51.31 25.65,50.8 | 25.65,50.8 26.42,50.04 JP3.2 | 20.07,68.33 27.18,61.21 v27.18,58.17 27.18,52.32 25.65,50.8 | v13.72,59.44 14.99,60.71 14.99,64.52 18.8,68.33 20.07,68.33 | 20.07,68.33 B1.2 | B2.2 52.07,41.15 52.32,41.4 52.32,45.47 53.09,46.23 53.09,47.5 51.82,48.77 51.82,51.31 B3.2 51.56,51.56 51.56,66.04 v49.78,66.04 | v11.18,32.26 11.18,28.19 v11.43,27.94 11.43,22.35 v10.67,21.59 | LED2.K 42.67,43.69 42.16,43.18 42.16,36.32 41.4,35.56 39.62,35.56 LED1.K | v31.5,52.83 31.5,55.12 32.51,55.12 33.02,55.63 33.02,57.4 LED4.K | v35.05,31.75 v35.05,24.64
MISO  (via drill 0.33)
  Top 0.254: v20.57,26.42 21.34,26.42 21.59,26.16 IC3.11 | v21.08,40.64 21.84,41.4 33.02,41.4 | 33.02,41.4 35.05,41.4 v36.83,39.62 | v34.54,57.15 v36.07,57.15 | v37.08,45.97 36.32,45.21 v34.04,45.21 | 33.02,41.4 v33.02,41.15
  Bottom 0.254: v20.57,26.42 21.08,26.92 v21.08,40.64 | v36.83,39.62 36.83,26.42 37.85,25.4 37.85,22.86 37.08,22.1 37.08,21.84 36.58,21.34 | 36.58,21.34 35.81,21.34 MICROSD.7 36.58,21.34 | 36.58,21.34 38.86,19.05 38.86,5.08 ISP.1 | v36.07,57.15 36.07,60.45 35.56,60.45 30.48,65.53 RAD.7 | v34.54,57.15 34.54,51.82 37.08,49.28 v37.08,45.97 | v34.04,45.21 33.02,44.2 v33.02,41.15
MOSI  (via drill 0.33)
  Top 0.254: v19.81,24.38 21.08,24.38 22.1,25.4 IC3.10 | v27.18,69.85 27.69,69.34 29.46,69.34 29.72,69.6 31.5,69.6 32.77,68.33 RAD.6 | v37.34,17.02 37.08,17.27 v32,17.27 | v29.72,29.21 22.35,29.21 21.59,28.45 v18.29,28.45
  Bottom 0.254: 37.34,16.76 38.35,16.76 38.35,6.35 37.59,5.59 37.59,1.78 38.1,1.27 41.15,1.27 41.15,2.29 ISP.4 | 37.34,16.76 35.81,16.76 MICROSD.3 | v19.81,24.38 18.29,25.91 v18.29,28.45 18.29,29.72 16.76,31.24 13.72,31.24 13.72,29.21 13.46,28.96 11.94,28.96 11.94,42.16 10.41,43.69 10.41,60.71 19.56,69.85 v27.18,69.85 | v37.34,17.02 37.34,16.76 | v32,17.27 31.5,17.78 31.5,27.43 v29.72,29.21
N$1
  Top 0.254: C2.1 10.92,13.72 8.64,13.72 7.62,14.73 IC4.3 7.37,14.99 5.08,14.99 2.03,18.03 SWITCH.3
N$2
  Top 0.254: C7.1 8.38,21.84 6.86,23.37 6.86,28.45 8.89,28.45 X3.P$1 9.14,28.7 13.97,28.7 13.97,25.65 14.73,24.89 15.75,24.89 16.76,23.88 IC3.16
N$3
  Top 0.254: X3.P$2 9.14,24.64 11.94,24.64 12.7,25.4 C6.1 12.95,25.4 13.97,24.38 14.99,24.38 16,23.37 IC3.17
N$4
  Top 0.254: WS10.I 12.7,40.89 12.7,42.93 13.21,43.43 13.21,46.23 15.75,46.23 WS9.O
N$5
  Top 0.254: PWR.C 52.07,17.78 52.07,20.32 50.8,20.32 IC2.1
N$6
  Top 0.254: IC2.5 50.8,17.78 50.8,16.51 53.09,16.51 53.34,16.26 53.34,1.02 49.53,1.02 48.26,2.29 48.26,4.32 47.24,4.32 RC.2
N$7  (via drill 0.33)
  Top 0.254: v7.62,35.05 10.92,35.05 11.68,35.81 Q4.3 | v7.37,51.31 10.67,54.61 v11.18,54.61 | v12.95,61.72 13.72,62.48 15.75,62.48 U$1.-
  Bottom 0.254: v7.62,35.05 7.37,35.31 v7.37,51.31 | v11.18,54.61 12.95,56.39 v12.95,61.72
N$8  (via drill 0.33)
  Top 0.254: v50.04,56.39 49.28,55.63 RN2.4 | v49.78,62.23 47.5,64.52 43.43,64.52 IC1.14
  Bottom 0.254: v50.04,56.39 49.78,56.64 v49.78,62.23
N$10  (via drill 0.33)
  Top 0.254: v49.53,14.99 51.56,14.99 52.07,15.49 PWR.A | v47.75,7.87 49.02,6.6 49.78,6.6 RE1.1
  Bottom 0.254: v49.53,14.99 48.51,13.97 48.51,9.4 47.75,8.64 v47.75,7.87
N$11  (via drill 0.33)
  Top 0.254: v48.26,54.36 48.26,55.37 RN2.3 | v49.02,61.47 47.24,63.25 43.43,63.25 IC1.15
  Bottom 0.254: v48.26,54.36 49.02,55.12 v49.02,61.47
N$12
  Top 0.254: NKA1.1 35.56,2.29 37.08,3.81 37.08,6.86 34.54,6.86 34.29,6.6 31.24,6.6 30.99,6.86 24.89,6.86 24.64,6.6 21.34,6.6 20.32,5.59 NKA.7
N$13  (via drill 0.33)
  Top 0.254: v41.4,58.42 45.21,54.61 47.5,54.61 47.5,55.37 RN2.2 | v41.4,60.96 42.42,61.98 43.18,61.98 IC1.16
  Bottom 0.254: v41.4,60.96 v41.4,58.42
N$14  (via drill 0.33)
  Top 0.254: v32.26,56.13 34.04,56.13 34.29,55.88 WS6.O | v31.5,58.93 31.5,60.2 30.73,60.2 WS7.I
  Bottom 0.254: v32.26,56.13 31.5,56.9 v31.5,58.93
N$15  (via drill 0.33)
  Top 0.254: v45.47,55.63 46.48,55.63 RN2.1 | v45.47,60.45 45.21,60.71 43.43,60.71 IC1.17
  Bottom 0.254: v45.47,60.45 v45.47,55.63
N$17  (via drill 0.33)
  Top 0.254: v44.7,56.39 45.97,56.39 46.48,56.9 RN2.8 | v46.99,36.83 44.45,34.29 41.91,34.29 41.66,34.04 LED1.A
  Bottom 0.254: v44.7,56.39 44.7,46.48 46.99,44.2 v46.99,36.83
N$18  (via drill 0.33)
  Top 0.254: v46.23,58.17 46.48,57.91 47.5,57.91 47.5,57.15 RN2.7 | v47.24,45.21 47.24,41.91 45.72,41.91 45.47,42.16 45.47,43.69 LED2.A
  Bottom 0.254: v46.23,58.17 46.23,46.23 v47.24,45.21
N$19  (via drill 0.33)
  Top 0.254: v39.62,41.91 40.64,41.91 WS4.O | v42.16,46.74 44.2,46.74 WS5.I
  Bottom 0.254: v39.62,41.91 40.89,43.18 40.89,45.21 42.16,46.48 v42.16,46.74
N$20  (via drill 0.33)
  Top 0.254: v37.34,50.55 39.12,50.55 39.88,49.78 WS5.O | v36.07,56.13 39.62,56.13 WS6.I
  Bottom 0.254: v37.34,50.55 36.07,51.82 v36.07,56.13
N$21
  Top 0.254: IC3.4 25.65,22.1 26.42,22.86 27.94,22.86 29.21,21.59 33.78,21.59 34.54,20.83 RD+1.2
N$22  (via drill 0.33)
  Top 0.254: v42.67,20.32 41.91,20.32 41.4,20.83 RD-1.2 | v41.15,15.49 40.89,15.75 29.21,15.75 v28.7,15.24 | v25.4,20.32 25.4,20.83 25.91,21.34 IC3.3
  Bottom 0.254: v42.67,20.32 41.15,18.8 v41.15,15.49 | v28.7,15.24 25.4,18.54 v25.4,20.32
N$23  (via drill 0.33)
  Top 0.254: v24.38,31.24 23.11,32.51 WS1.O | v24.89,28.45 25.15,28.19 26.67,28.19 WS2.I
  Bottom 0.254: v24.38,31.24 24.89,30.73 v24.89,28.45
N$24
  Top 0.254: WS2.O 30.73,31.24 32.26,29.72 35.56,29.72 WS3.I
N$25  (via drill 0.33)
  Top 0.254: v38.1,36.07 37.08,36.07 37.08,34.8 WS3.O | v41.4,36.83 42.67,36.83 WS4.I
  Bottom 0.254: v38.1,36.07 38.86,36.83 v41.4,36.83
N$26  (via drill 0.33)
  Top 0.254: v43.94,57.15 45.72,58.93 46.74,58.93 47.24,58.42 48.26,58.42 48.26,57.15 RN2.6
  Bottom 0.254: v43.94,57.15 42.67,55.88 42.67,54.1 LED3.A
N$27  (via drill 0.33)
  Top 0.254: v16,51.05 13.97,51.05 WS9.I | v18.8,54.36 19.81,53.34 WS8.O
  Bottom 0.254: v16,51.05 18.8,51.05 v18.8,54.36
N$28  (via drill 0.33)
  Top 0.254: v22.61,57.15 22.35,57.15 21.08,58.42 WS8.I | v24.89,56.13 25.65,56.9 26.42,56.9 WS7.O
  Bottom 0.254: v22.61,57.15 23.62,56.13 v24.89,56.13
N$29  (via drill 0.33)
  Top 0.254: v48.26,59.18 49.02,59.18 49.02,57.15 RN2.5
  Bottom 0.254: v48.26,59.18 48.01,59.44 48.01,62.48 40.39,70.1 28.96,70.1 28.96,64.77 33.78,59.94 LED4.A
N$30  (via drill 0.33)
  Top 0.254: v18.03,59.44 19.3,59.44 19.81,59.94 21.84,59.94 21.84,59.44 22.61,58.67 23.11,58.67 24.13,57.66 LED5.K
  Bottom 0.254: LED8.K 17.02,35.56 16.51,35.05 16.51,33.78 15.49,32.77 13.72,32.77 13.72,43.18 14.48,43.94 LED7.K 14.48,44.2 14.99,44.7 14.99,52.32 17.27,52.32 LED6.K 17.53,52.58 17.53,58.93 v18.03,59.44
N$31  (via drill 0.33)
  Top 0.254: v21.84,9.65 19.81,9.65 T1.1
  Bottom 0.254: v21.84,9.65 22.86,8.64 22.86,5.33 NKA.6 22.61,5.08 22.61,4.57 20.32,2.29 NKA1.7
N$32  (via drill 0.33)
  Top 0.254: v26.42,52.83 27.69,52.83 RN1.8
  Bottom 0.254: v26.42,52.83 25.65,53.59 25.65,58.17 23.62,60.2 LED5.A
N$33  (via drill 0.33)
  Top 0.254: v26.42,55.63 27.43,55.63 27.69,55.37 RN1.5
  Bottom 0.254: v26.42,55.63 26.16,55.88 26.16,59.18 23.62,61.72 15.49,61.72 15.49,54.1 LED6.A
N$34  (via drill 0.33)
  Top 0.254: v19.3,55.88 21.08,54.1 22.61,54.1 22.86,54.36 27.69,54.36 RN1.6 | v14.73,58.42 v18.29,58.42
  Bottom 0.254: v19.3,55.88 18.29,56.9 v18.29,58.42 | v14.73,58.42 13.46,57.15 13.46,51.82 11.94,50.29 LED7.A
N$35  (via drill 0.33)
  Top 0.254: v24.38,53.59 27.69,53.59 RN1.7 | v22.1,49.28 21.59,48.77 v20.07,48.77
  Bottom 0.254: v24.38,53.59 22.1,51.31 v22.1,49.28 | v20.07,48.77 15.75,44.45 15.75,34.8 15.24,34.29 LED8.A
N$37  (via drill 0.33)
  Top 0.254: v30.48,52.83 29.46,52.83 RN1.1 | v30.73,61.47 31.5,62.23 39.88,62.23 41.66,64.01 41.66,65.79 43.18,65.79 IC1.13
  Bottom 0.254: v30.48,52.83 30.73,53.09 v30.73,61.47
N$38  (via drill 0.33)
  Top 0.254: v35.31,53.59 29.46,53.59 RN1.2 | v35.31,59.69 37.08,61.47 v37.85,61.47 | v38.61,63.75 41.91,67.06 43.18,67.06 IC1.12
  Bottom 0.254: v35.31,59.69 v35.31,53.59 | v37.85,61.47 38.61,62.23 v38.61,63.75
N$39  (via drill 0.33)
  Top 0.254: v32.26,54.36 29.46,54.36 RN1.3 | v33.78,52.83 34.29,52.32 v36.83,52.32 | v37.85,56.9 38.61,57.66 40.89,57.66 v41.15,57.4 | v41.4,67.82 41.91,68.33 43.18,68.33 IC1.11
  Bottom 0.254: v33.78,52.83 v32.26,54.36 | v36.83,52.32 37.85,53.34 v37.85,56.9 | v41.15,57.4 42.16,57.4 42.16,67.06 v41.4,67.82
N$40  (via drill 0.33)
  Top 0.254: v28.45,56.13 29.21,55.37 RN1.4 | v28.19,70.1 42.93,70.1 43.18,69.85 IC1.10
  Bottom 0.254: v28.45,56.13 28.19,56.39 v28.19,70.1
RESET  (via drill 0.33)
  Top 0.254: 17.53,26.16 16,26.16 v15.49,25.65 | 17.53,26.16 17.78,26.16 18.29,25.65 IC3.13 | v12.7,11.94 10.92,10.16 RST.B' | v32,8.13 40.64,8.13 43.69,5.08 ISP.5 | v29.21,26.42 22.86,26.42 22.1,27.18 18.54,27.18 17.53,26.16 | v11.94,4.57 10.92,4.57 10.92,3.3 RST.B
  Bottom 0.254: v15.49,25.65 14.73,24.89 14.73,14.73 14.22,14.22 12.7,14.22 v12.7,11.94 13.46,11.18 13.46,6.1 v11.94,4.57 | v32,8.13 29.46,10.67 29.46,19.56 29.21,19.81 v29.21,26.42
RX  (via drill 0.33)
  Top 0.254: v6.35,31.5 6.86,30.99 14.48,30.99 v15.49,32 | v19.56,36.58 19.81,36.32 23.11,36.32 23.62,35.81 25.15,35.81 26.42,37.08 JP5.4 | v27.94,45.72 20.83,45.72 v20.07,46.48
  Bottom 0.254: v6.35,31.5 6.35,36.83 2.54,40.64 2.54,50.04 1.27,51.31 1.27,53.34 2.54,54.61 JP2.7 | v15.49,32 19.56,36.07 v19.56,36.58 19.56,45.97 v20.07,46.48 | v27.94,45.72 29.97,43.69 29.97,41.4 31.5,39.88 JP1.4
SCK  (via drill 0.33)
  Top 0.254: v24.64,25.65 23.37,25.65 22.86,25.15 IC3.9 | v27.94,18.54 28.19,18.8 v34.29,18.8 | v33.78,7.37 38.86,7.37 41.15,5.08 ISP.3 | v36.32,64.26 34.29,64.26 33.02,65.53 RAD.5 | v43.69,45.47 43.94,45.21 45.97,45.21 46.74,44.45 46.74,42.67 v46.23,42.67
  Bottom 0.254: v24.64,25.65 27.94,22.35 v27.94,18.54 | MICROSD.5 35.56,19.05 35.56,18.8 v34.29,18.8 34.04,18.54 34.04,7.62 v33.78,7.37 | v36.32,64.26 37.08,63.5 37.08,58.93 38.61,57.4 38.61,47.24 39.37,46.48 41.4,46.48 41.4,47.24 42.42,48.26 43.69,48.26 v43.69,45.47 | v46.23,42.67 45.21,41.66 45.21,26.42 43.69,24.89 43.69,7.37 41.4,5.08 ISP.3
SCL  (via drill 0.33)
  Top 0.254: RSCL.1 2.54,68.58 2.54,65.79 2.03,65.79 0.51,64.26 0.51,59.94 2.54,59.94 JP2.3 | 4.57,49.53 4.57,47.5 4.32,47.24 2.29,47.24 2.03,46.99 EEPRM.6 | v1.78,49.53 4.57,49.53 | 12.19,22.35 13.46,23.62 14.73,23.62 15.49,22.86 IC3.18 | 12.19,22.35 12.19,19.3 30.73,19.3 v32.26,20.83 | v52.58,57.91 52.58,59.44 IC1.1 | v53.09,44.96 v53.09,48.77 | v53.09,32 51.82,30.73 48.01,30.73 47.75,30.99 46.74,30.99 45.72,29.97 38.61,29.97 35.81,27.18 v32.51,27.18 | v28.19,42.67 28.45,42.42 35.05,42.42 35.31,42.67 36.83,42.67 40.13,39.37 43.69,39.37 43.94,39.12 v52.58,39.12 | v5.59,50.55 4.57,49.53 | v10.67,22.86 11.18,22.35 12.19,22.35
  Bottom 0.254: v1.78,49.53 0.76,50.55 0.76,57.4 2.54,59.18 2.54,59.69 JP2.3 | v32.26,20.83 32.51,21.08 v32.51,27.18 32.51,36.32 31.75,37.08 JP5.2 | v52.58,57.91 53.09,57.4 v53.09,48.77 | v53.09,44.96 53.34,44.7 53.34,39.12 | 53.34,39.12 53.34,32.26 v53.09,32 | v28.19,42.67 28.19,41.4 26.67,39.88 JP1.2 | 53.34,39.12 v52.58,39.12 | v5.59,50.55 6.6,51.56 6.6,51.82 6.86,52.07 8.13,52.07 8.13,35.81 9.4,34.54 9.4,24.13 v10.67,22.86
SDA  (via drill 0.33)
  Top 0.254: v47.24,60.71 52.32,60.71 IC1.2 | v46.99,48.77 41.4,48.77 40.64,48.01 v36.32,48.01 | v36.32,43.69 35.81,43.18 v29.21,43.18 | v1.27,63.75 3.81,66.29 RSDA.1 | v1.02,58.93 2.54,57.4 JP2.5 2.54,57.15 1.02,57.15 1.02,49.02 1.78,48.26 EEPRM.5 2.03,48.01 v3.81,48.01 | v22.86,21.34 15.75,21.34 15.24,21.84 IC3.19 14.99,22.1 14.22,22.86 v13.97,22.86 | JP1.3 29.21,39.88 29.21,37.59 JP5.3
  Bottom 0.254: v47.24,60.71 46.99,60.45 v46.99,48.77 | v36.32,43.69 v36.32,48.01 | v29.21,43.18 29.21,40.13 JP1.3 | v1.27,63.75 1.02,63.5 v1.02,58.93 | v22.86,21.34 23.37,21.84 23.37,31.5 24.89,33.02 28.96,33.02 28.96,37.34 JP5.3 | v3.81,48.01 6.86,44.96 6.86,34.54 8.38,33.02 8.89,33.02 8.89,18.54 12.7,14.73 13.97,14.73 v13.97,22.86
TX  (via drill 0.33)
  Top 0.254: v6.1,42.16 8.38,39.88 11.68,39.88 12.45,39.12 15.75,39.12 16.51,39.88 21.59,39.88 23.88,37.59 JP5.5 | v34.04,35.05 32.77,33.78 v27.69,33.78
  Bottom 0.254: v6.1,42.16 3.05,45.21 3.05,51.82 2.79,52.07 JP2.9 | v34.04,35.05 35.56,36.58 35.56,38.61 34.29,39.88 JP1.5 | v27.69,33.78 24.13,37.34 JP5.5
VBAT  (via drill 0.33)
  Top 0.254: v47.75,19.81 48.01,19.81 48.51,20.32 IC2.3 | 48.01,13.97 50.29,11.68 BAT1.P$2 | 48.01,13.97 v47.75,14.22 | v4.32,37.59 6.35,37.59 7.11,38.35 USB.1 | 48.01,13.97 42.93,8.89 25.91,8.89 25.65,8.64 22.86,8.64 22.35,8.13 v22.1,8.13 | v20.83,10.41 20.57,10.67 19.3,10.67 18.54,9.91 18.54,9.14 16.76,9.14 15.49,7.87 9.91,7.87 v8.89,8.89
  Bottom 0.254: v47.75,14.22 v47.75,19.81 | 4.06,23.11 SWITCH.2 | 4.06,23.11 4.06,30.73 JP4.2 4.32,30.99 v4.32,37.59 | v22.1,8.13 20.83,9.4 v20.83,10.41 | v8.89,8.89 4.06,13.72 4.06,23.11
VBUS  (via drill 0.33)
  Top 0.254: v23.11,43.94 21.08,43.94 | 21.08,43.94 19.81,43.94 19.3,43.43 C1.1 | v18.8,60.2 7.37,60.2 5.33,62.23 JP2.2 | v20.07,50.04 23.88,50.04 JP3.1 | 52.83,8.64 52.83,6.6 52.07,6.6 RE1.2 | 52.83,8.64 52.83,13.97 52.58,14.22 48.77,14.22 48.77,17.78 IC2.4 48.77,18.03 v49.53,18.03 | 52.83,8.64 46.99,8.64 46.99,6.35 44.45,3.81 40.89,3.81 40.39,3.3 39.62,3.3 38.86,2.54 ISP.2 | 36.07,25.65 44.45,25.65 44.7,25.91 X2.VBUS 44.96,26.16 46.48,26.16 46.99,26.67 47.75,26.67 v49.28,25.15 | 36.07,25.65 25.91,25.65 24.13,23.88 IC3.7 | 36.07,25.65 v36.07,25.91 | 21.08,43.94 21.08,41.91 v35.81,41.91
  Bottom 0.254: v23.11,43.94 22.61,44.45 22.61,48.51 23.88,49.78 23.88,50.04 JP3.1 | v18.8,60.2 20.07,58.93 v20.07,50.04 | 34.8,41.91 34.8,41.4 36.07,40.13 v36.07,25.91 | 34.8,41.91 34.8,46.99 34.29,47.5 JP6.1 | v49.53,18.03 49.02,18.54 49.02,24.89 v49.28,25.15 | 34.8,41.91 v35.81,41.91
VCC  (via drill 0.33)
  Top 0.254: 49.78,59.18 49.02,59.94 46.23,59.94 45.97,59.69 43.43,59.69 IC1.18 43.18,59.44 v39.37,59.44 37.59,59.44 36.58,58.42 WS6.D | 49.78,59.18 52.07,56.9 CEXP1.1 52.32,56.64 53.34,56.64 53.34,51.05 52.32,50.04 43.94,50.04 43.43,50.55 WS5.D | v50.55,65.28 51.82,65.28 52.32,65.79 IC1.6 | 49.78,59.18 v50.55,59.94 | 3.3,42.93 2.03,44.2 EEPRM.8 | 3.3,42.93 6.86,39.37 11.43,39.37 13.72,37.08 WS10.D 13.72,36.83 v12.95,36.07 | 11.43,46.23 8.13,42.93 3.3,42.93 | 11.43,46.23 12.45,47.24 WS9.D | WS8.D 17.53,56.13 16.51,57.15 5.33,57.15 JP2.6 | JP6.3 29.21,47.75 29.21,50.04 JP3.3 | RSCL.2 4.83,68.58 5.84,68.58 5.84,66.55 RSDA.2 6.1,66.29 11.43,60.96 | 11.43,60.96 10.41,60.96 8.89,62.48 U$1.+ 8.64,62.48 7.87,62.48 v7.11,61.72 | 11.43,60.96 17.02,60.96 17.53,61.47 25.4,61.47 26.42,60.45 WS7.D 26.67,60.2 27.94,60.2 | 27.94,60.2 v29.21,58.93 | 11.43,46.23 9.4,48.26 v9.14,48.26 | v39.37,62.99 39.12,62.74 30.48,62.74 27.94,60.2 | 27.94,17.78 27.94,16.76 27.18,16 26.67,16 26.16,16.51 IC3.42 | 27.94,17.78 27.43,17.78 IC3.44 | 27.94,17.78 28.45,17.78 28.7,18.03 v37.34,18.03 45.97,18.03 45.97,20.57 RU1.2 46.23,20.83 47.5,20.83 v47.75,21.08 | v45.97,39.88 44.96,39.88 44.2,40.64 WS4.D | 17.53,29.72 20.83,29.72 WS1.D 21.08,29.97 30.48,29.97 30.48,28.19 WS2.D 30.73,27.94 35.81,27.94 37.34,29.46 37.34,30.23 38.86,31.75 WS3.D 39.12,32 41.4,32 43.18,33.78 45.72,33.78 v45.97,34.04 | 17.53,29.72 15.75,29.72 15.49,29.97 v12.95,29.97 6.35,29.97 6.35,17.02 IC4.2 | C4.1 39.37,23.37 38.86,22.86 32.51,22.86 32,22.35 30.23,22.35 29.21,23.37 C3.1 29.21,23.62 28.96,23.88 25.15,23.88 24.64,23.37 IC3.6 24.38,23.11 23.88,22.61 20.32,22.61 v19.56,23.37 18.03,24.89 IC3.14
  Top 0.254: 23.11,9.65 22.35,8.89 20.83,8.89 20.83,7.87 T1.2 | 21.84,11.18 21.84,10.41 22.35,10.41 23.11,9.65 | 21.84,11.18 21.84,12.19 IC3.34 | 23.11,9.65 T2.2 | v6.86,2.79 6.86,1.52 C9.1 | v13.46,13.46 12.45,13.46 12.45,16 12.7,16.26 12.95,16.26 13.97,17.27 IC3.24 14.22,17.53 14.99,18.29 16.76,18.29 v17.02,18.54 | 21.84,11.18 19.05,11.18 18.8,10.92 v17.27,10.92 | v17.53,29.21 17.53,29.72
  Bottom 0.254: v50.55,59.94 v50.55,65.28 | v39.37,59.44 v39.37,62.99 39.37,66.8 38.1,68.07 RAD.2 | v29.21,58.93 29.21,50.29 JP3.3 | v7.11,61.72 7.11,59.18 5.33,57.4 JP2.6 5.33,57.15 8.64,53.85 8.64,48.77 v9.14,48.26 | 48.51,20.32 48.51,17.78 50.29,16 50.29,8.38 50.8,7.87 RSD.2 | v47.75,21.08 48.51,20.32 | v37.34,18.03 35.81,18.03 MICROSD.4 | v45.97,39.88 46.23,39.62 46.23,34.04 | 46.23,34.04 46.23,28.19 48.51,25.91 48.51,20.32 | THM1.2 3.05,10.41 4.57,8.89 4.57,5.08 v6.86,2.79 6.86,2.29 10.92,2.29 13.97,5.33 13.97,12.95 v13.46,13.46 | v17.27,10.92 17.02,11.18 v17.02,18.54 17.02,20.83 17.53,21.34 | 17.53,21.34 v19.56,23.37 | 17.53,21.34 v17.53,29.21 | v45.97,34.04 46.23,34.04 | v12.95,29.97 v12.95,36.07

### Text on the board
tNames: ***** | PUBLIC | OPEN | LAB | .org | LUX | **** | REV-T | VBUS | GND | A0 | A1 | VCC | A2 | SCL | SDA | RX | TX | USB | GND | VBAT
bNames: (X) | MOSI | A4 | VCC | Hardware License | A2 | GND | MISO | SCK | A5 | GND | A1 | VCC | CERN Open | Ver. 1.1 | A0 | VBUS | TX | SCL | RX | SDA | A1 | A0 | VCC | VBUS | GND | TX | RX | SDA | SCL | A2 | PUBLICLAB.ORG/WIKI/OPEN-LUX | GND | LED | LCD | D8 | D9 | A3 | GND | A4 | GND | LCD | D8 | D9 | A3 | GND | A4 | LED | SCK | MISO | RST | VBUS | GND | MOSI